# Altium schematic sheet Encoder Circuit (1).SchDoc
size A4
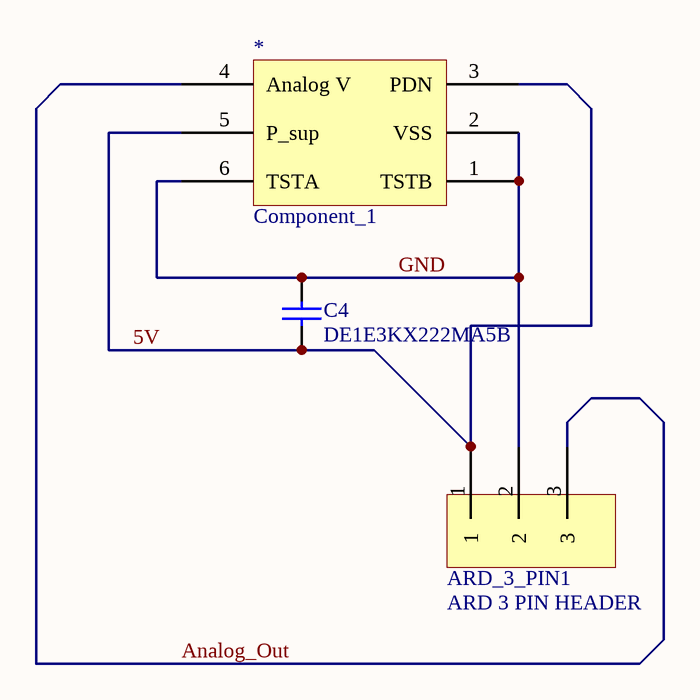
[diagram p0: Encoder Circuit (1).SchDoc]

## Parts
*  Component_1
ARD_3_PIN1  ARD 3 PIN HEADER  [4 PIN HEADER]
C4  DE1E3KX222MA5B  [MURA-DE1E3KX222MA5]

## Nets
5V: *.3(PDN) *.5(P_sup) ARD_3_PIN1.1 C4.1
Analog_Out: *.4(Analog_V) ARD_3_PIN1.3
GND: *.1(TSTB) *.2(VSS) *.6(TSTA) ARD_3_PIN1.2 C4.2

## Library data of the parts
ARD_3_PIN1 = ARD_3_PIN?
C4 = CMP-2000-06146-1: Ceramic Capacitor, 2.2 nF, +/- 20%, 250 V, -25 to 85 degC, 2-Pin THD, RoHS, Bulk; Manufacturer: Murata; Capacitor Case Style: Disc; Body Diameter: 12mm; Capacitor Application: Safety/Suppression; Voltage Rating: 250VAC; Dielectric Characteristic: E; Lead Length: 25mm; External Width: 10mm; SVHC: NoSVHC(19-Dec-2012); Capacitance: 2200pF; Suppression Class: X1/Y1; Proof Voltage: 4000V; Capacitor Terminals: RadialLeaded; No. of Pins: 2; Voltage Rating V AC: 250V; Operating Temperature Min: -25°C; Series: KX; Lead Spacing: 10mm; Package Description: 2-Pin Through Hole Device, Radial, Dia 10 mm, Heigh 14 mm; Datasheet URL: http://www.murata.com/~/media/webrenewal/campaign/ads/america/amr_ami/c85e.ashx?la=en-us; Datasheet Version: 04/2014; Tolerance -: 20%; Tolerance +: 20%; Mounting Technology: ThroughHole; Capacitance Tolerance: ±20%; Manufacturer URL: http://www.murata.com/; Operating Temperature Max: 125°C; Package Reference: DE1E3KX222MA5; Operating Temperature Range: -25°Cto+125°C